# Altium project EDR_to_submit.PrjPcb
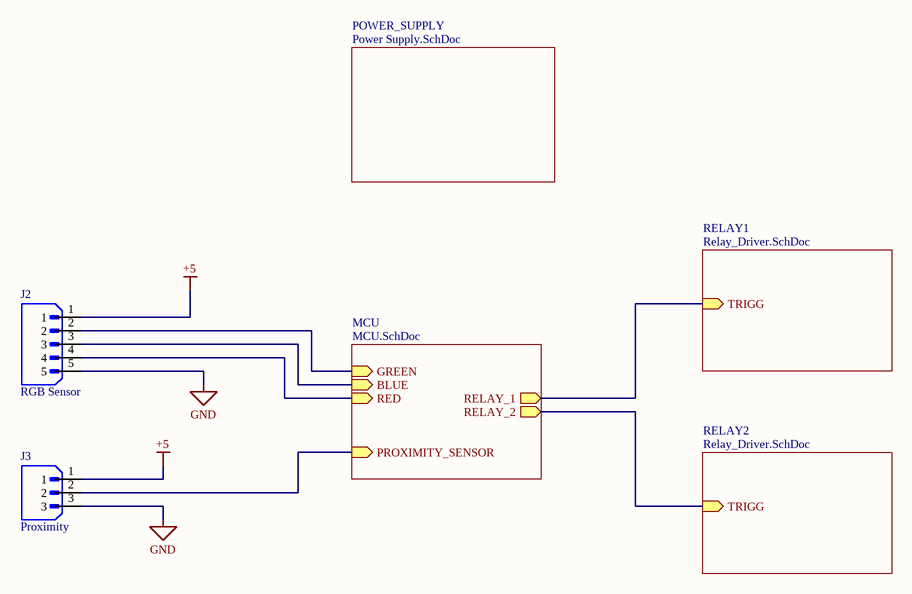
[diagram p0: Main.SchDoc]
4 sheets, 23 parts. Net scope: hierarchical (ports join the sheet entries above them; power ports are global).
Board file: PCB1.PcbDoc
Sheets:
  Main.SchDoc
    MCU = MCU.SchDoc
    RELAY1 = Relay_Driver.SchDoc
    POWER_SUPPLY = Power Supply.SchDoc
    RELAY2 = Relay_Driver.SchDoc

## Sheet Main.SchDoc: Main Circuit
size A; SheetNumber: 1; SheetTotal: 4

### Parts
J2  RGB Sensor  [JST_B5B-XH-A(LF)(SN)]
J3  Proximity  [JST_B3B-XH-A (LF)(SN)]

### Sub-sheets
MCU = MCU.SchDoc: GREEN (in), RELAY_1 (out), BLUE (in), RELAY_2 (out), PROXIMITY_SENSOR (in), RED (in)
POWER_SUPPLY = Power Supply.SchDoc: no entries
RELAY1 = Relay_Driver.SchDoc: TRIGG (in)
RELAY2 = Relay_Driver.SchDoc: TRIGG (in)

### Nets
+5: J2.1 J3.1
GND: J2.5 J3.3
NetJ2_2: J2.2 ; sheet MCU/GREEN
NetJ2_3: J2.3 ; sheet MCU/BLUE
NetJ2_4: J2.4 ; sheet MCU/RED
NetJ3_2: J3.2 ; sheet MCU/PROXIMITY_SENSOR
NetR2A_1: sheet MCU/RELAY_1, sheet RELAY1/TRIGG
NetR2B_1: sheet MCU/RELAY_2, sheet RELAY2/TRIGG

### Library data of the parts
J2 = B5B-XH-A(LF)(SN): Connector Header Through Hole 5 position 0.098 (2.50mm); MF: JST Sales America Inc.; SnapEDA_Link: https://www.snapeda.com/parts/B5B-XH-A(LF)(SN)/JST+Sales+America+Inc./view-part/?ref=snap; Package: None; Value: *; MP: B5B-XH-A(LF)(SN); Check_prices: https://www.snapeda.com/parts/B5B-XH-A(LF)(SN)/JST+Sales+America+Inc./view-part/?ref=eda
J3 = B3B-XH-A_(LF)(SN): Connector Header Through Hole 3 position 0.098 (2.50mm); MF: JST Sales America Inc.; MP: B3B-XH-A (LF)(SN); SnapEDA_Link: https://www.snapeda.com/parts/B3B-XH-A%20(LF)(SN)/JST+Sales+America+Inc./view-part/?ref=snap; Package: None; Value: *; Check_prices: https://www.snapeda.com/parts/B3B-XH-A%20(LF)(SN)/JST+Sales+America+Inc./view-part/?ref=eda

## Sheet MCU.SchDoc: Microcontroller circuit
size A; DrawnBy: Nidula Gunawardana; SheetNumber: 2; SheetTotal: 4
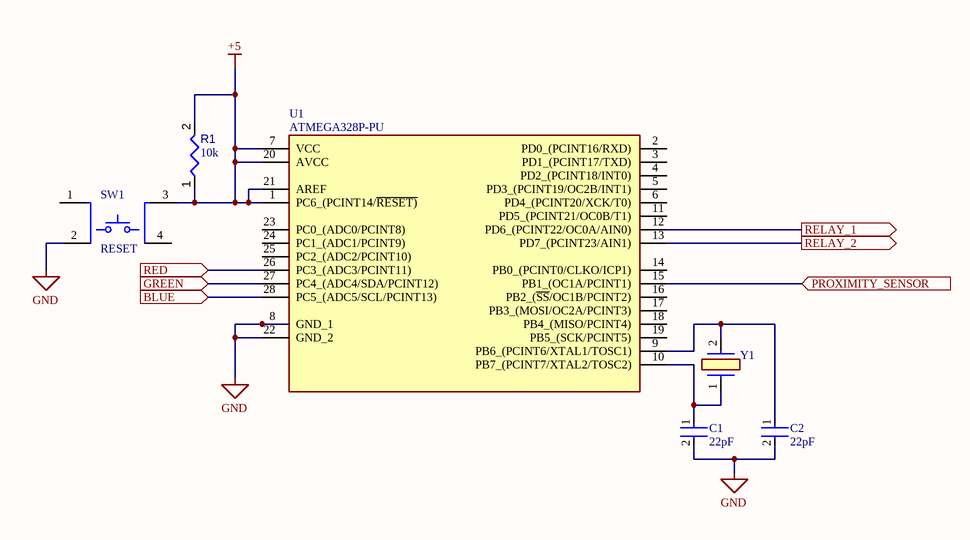
[diagram p1: MCU.SchDoc]

### Parts
C1  22pF  [FP-RCE0DB-MFG]
C2  22pF  [FP-RCE0DB-MFG]
R1  value 10k  [RESA60-630X240]  (hidden comment: MFR-25FBF52-10K)
SW1  RESET  [FP-SKQBARA010-MFG]
U1  ATMEGA328P-PU  [DIP794W53P254L3467H457Q28N]
Y1  ECS-160-S-4X  [ECS160S4X]  (value not drawn)

### Ports
BLUE (in), GREEN (in), PROXIMITY_SENSOR (in), RED (in), RELAY_1 (out), RELAY_2 (out)

### Nets
+5: R1.1 R1.2 SW1.3 U1.1(PC6_(PCINT14/~{RESET)}) U1.7(VCC) U1.20(AVCC) U1.21(AREF)
GND: C1.2 C2.2 SW1.2 U1.8(GND_1) U1.22(GND_2)
NetC1_1: C1.1 U1.10(PB7_(PCINT7/XTAL2/TOSC2)) Y1.1
NetC2_1: C2.1 U1.9(PB6_(PCINT6/XTAL1/TOSC1)) Y1.2
NetJ2_2: U1.27(PC4_(ADC4/SDA/PCINT12)) ; port GREEN
NetJ2_3: U1.28(PC5_(ADC5/SCL/PCINT13)) ; port BLUE
NetJ2_4: U1.26(PC3_(ADC3/PCINT11)) ; port RED
NetJ3_2: U1.15(PB1_(OC1A/PCINT1)) ; port PROXIMITY_SENSOR
NetR2A_1: U1.12(PD6_(PCINT22/OC0A/AIN0)) ; port RELAY_1
NetR2B_1: U1.13(PD7_(PCINT23/AIN1)) ; port RELAY_2

Not connected (* = marked no-connect by the designer): SW1 1 4; U1 2(PD0_(PCINT16/RXD)) 3(PD1_(PCINT17/TXD)) 4(PD2_(PCINT18/INT0)) 5(PD3_(PCINT19/OC2B/INT1)) 6(PD4_(PCINT20/XCK/T0)) 11(PD5_(PCINT21/OC0B/T1)) 14(PB0_(PCINT0/CLKO/ICP1)) 16(PB2_(~{SS}/OC1B/PCINT2)) 17(PB3_(MOSI/OC2A/PCINT3)) 18(PB4_(MISO/PCINT4)) 19(PB5_(SCK/PCINT5)) 23(PC0_(ADC0/PCINT8)) 24(PC1_(ADC1/PCINT9)) 25(PC2_(ADC2/PCINT10))

### Library data of the parts
C1 C2 = CMP-06035-047347-1: Cap Ceramic 22pF 100V C0G ±5% Radial 2.5mm +125°C Ammo Pack; Lead Diameter: 0.5mm; Lead/Base Style: Straight; Height: 3.5mm; Voltage: 100V; Mount: Through Hole; Min Operating Temperature: -55°C; Height - Seated (Max): 0.138inch; Dielectric: C0G; Width: 0.098inch; Depth: 2.5mm; Lead Pitch: 0.098inch; Packaging: Tape and Reel; Voltage Rating (DC): 100V; Capacitance: 22pF; Package Quantity: 2000; Max Operating Temperature: 125°C; Tolerance: 5%; Termination: Radial; Voltage Rating: 100V; Case/Package: Radial; Resistor Type: Ceramic; Length: 3.6mm; Ratings: AEC-Q200
R1 = CMP-009-00047-4: Axial Resistor, 10 KOhm, +/- 1%, 0.25 W, -55 to 155 degC, 2-Pin THD, RoHS, Bulk; Manufacturer: Yageo; Power: 250mW; Voltage Rating: 250V; Manufacturer URL: http://www.yageo.com/; Datasheet URL: http://www.yageo.com/documents/recent/Yageo%20LR_MFR_2013.pdf; Package Reference: MFR-25; Min Operating Temperature: -55°C; Mounting Technology: TH; Package Quantity: 200; Case/Package: Axial; Tolerance: 1%; RoHS Compliant: True; Datasheet Version: Apr-13; Packaging: Bulk; Max Operating Temperature: 155°C; Package Description: 2-Pin Axial Lead, Dia 2.4 mm, Body Length 6.3 mm
SW1 = CMP-00631-07849992-1: SKQBARA010 Switch Tactile N.O. SPST Round Button PC Pins 0.05A 12VDC 1.57N Thru-Hole Automotive; Life (Cycles): 100kcycles; Max Voltage Rating (DC): 12V; Contact Current Rating: 50mA; Contact Resistance: 500mΩ; Actuator Length: 850µm; Number of Positions: 2; Max Operating Temperature: 90°C; Throw Configuration: SPST; Contact Plating: Silver; Electrical Life: 100kcycles; RoHS: Compliant; Height: 5mm; Voltage Rating (DC): 12V; Termination: PC Pins; Orientation: Straight; Depth: 10.3mm; NexarPartId: 7849992; Packaging: Bulk; Color: Grey; Operating Force: 1.57N; Radiation Hardening: No; Schedule B: 8536509065, 8536509065; Current Rating: 50mA; Lead Free: Lead Free; Length: 10mm; Mount: Through Hole; Max Current Rating: 50mA; Min Operating Temperature: -40°C
U1 = ATMEGA328P-PU: Integrated Circuit; Manufacturer_Name: Microchip; Datasheet Link: https://www.mouser.ca/datasheet/2/268/ATmega48A_PA_88A_PA_168A_PA_328_P_DS_DS40002061B-3050139.pdf; Height: 4.572mm; Manufacturer_Part_Number: ATMEGA328P-PU; Mouser Part Number: 556-ATMEGA328P-PU; Mouser Price/Stock: https://www.mouser.co.uk/ProductDetail/Microchip-Technology/ATMEGA328P-PU?qs=K8BHR703ZXguOQv3sKbWcg%3D%3D; Arrow Part Number: ATMEGA328P-PU; Arrow Price/Stock: https://www.arrow.com/en/products/atmega328p-pu/microchip-technology?region=europe
Y1 = ECS-160-S-4X: Crystal or Oscillator; Manufacturer_Name: ECS; Datasheet Link: http://www.ecsxtal.com/store/pdf/hc-49usx.pdf; Height: 3.5mm; Manufacturer_Part_Number: ECS-160-S-4X; Mouser Part Number: 520-HCU1600-SX; Mouser Price/Stock: https://www.mouser.co.uk/ProductDetail/ECS/ECS-160-S-4X?qs=CNVyLAqdhH109We7RtSowA%3D%3D; Arrow Part Number: ECS-160-S-4X; Arrow Price/Stock: https://www.arrow.com/en/products/ecs-160-s-4x/ecs-international?region=nac

## Sheet Relay_Driver.SchDoc: Relay Unit
size A; SheetNumber: 3; SheetTotal: 4
Used 2 times, as channels RELAY1, RELAY2. Parts and nets are listed once, with the designators drawn on the sheet.
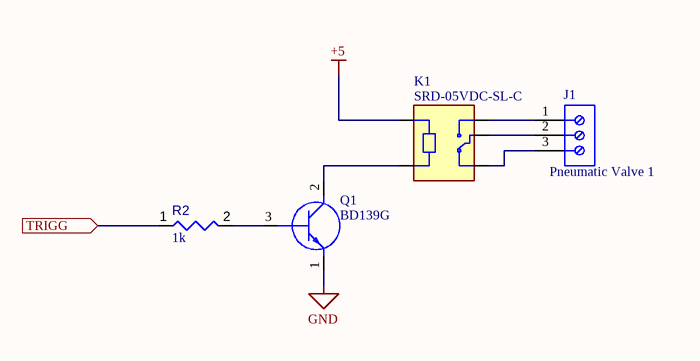
[diagram p2: Relay_Driver.SchDoc]

### Parts
J1  Pneumatic Valve 1  [691101710003]
K1  SRD-05VDC-SL-C  [RELAY_SRD-05VDC-SL-C]
Q1  BD139G  [TO229P300X760X1364-3P]
R2  value 1k  [RESA60-630X240]  (hidden comment: MFR-25FBF52-1K)

### Ports
TRIGG (in)

### Nets
+5: K1.A1
GND: Q1.1(E)
TRIGG: R2.1 ; port TRIGG
NetJ1_1: J1.1 K1.NO
NetJ1_2: J1.2 K1.COM
NetJ1_3: J1.3 K1.NC
NetK1_A2: K1.A2 Q1.2(C)
NetQ1_3: Q1.3(B) R2.2

### Channels
RELAY1: designators end in A; ports TRIGG=NetR2A_1
RELAY2: designators end in B; ports TRIGG=NetR2B_1

### Library data of the parts
J1 = CMP-1502-03257-2: NexarPartId: 8917705; Voltage Rating: 250V; Current: 16A; Wire Gauge (Min): 14AWG; Pitch: 5.0038mm; Wire Gauge (Max): 26AWG; Number of Positions Per Level: 3; Plating: Steel; Number of Levels: 1; Stripping Length: -7mm; REACH SVHC: Unknown; Width: 16.2mm; Height: 16.4mm; Contact Material: Brass; RoHS: Compliant; Color: Blue; Contact Plating: Tin; Lead Pitch: 5mm; Packaging: Box; Termination: Screw; Number of Contacts: 3; Wire/Cable Gauge: 26AWG; Min Operating Temperature: -40°C; Max Operating Temperature: 105°C; Housing Material: Nylon; Length: 9mm; Voltage: 250V; Mount: Through Hole; Current Rating: 16A; Number of Pins: 3
K1 = SRD-05VDC-SL-C: 5V Trigger Relay Module For Arduino And Raspberry Pi 5V Trigger Relay Module For Arduino And Raspberry Pi; MF: Songle Relay; Check_prices: https://www.snapeda.com/parts/SRD-05VDC-SL-C/Songle+Relay/view-part/?ref=eda; Value: *; Availability: Not in stock; Price: None; Package: NON STANDARD-5 Songle Relay; MP: SRD-05VDC-SL-C; SnapEDA_Link: https://www.snapeda.com/parts/SRD-05VDC-SL-C/Songle+Relay/view-part/?ref=snap
Q1 = BD139G: Transistor BJT NPN; Manufacturer_Name: onsemi; Datasheet Link: http://www.onsemi.com/pub/Collateral/BD135-D.PDF; Height: 3mm; Manufacturer_Part_Number: BD139G; Mouser Part Number: 863-BD139G; Mouser Price/Stock: https://www.mouser.co.uk/ProductDetail/onsemi/BD139G?qs=vNc2DXHODiLIqGggNMT6cg%3D%3D; Arrow Part Number: BD139G; Arrow Price/Stock: https://www.arrow.com/en/products/bd139g/on-semiconductor?region=nac
R2 = CMP-009-00048-4: Axial Resistor, 1 KOhm, +/- 1%, 250 mW, -55 to 155 degC, 2-Pin THD, RoHS, Bulk; Manufacturer: Yageo; Voltage Rating: 250V; Power: 250mW; Min Operating Temperature: -55°C; Max Operating Temperature: 155°C; Tolerance: 1%; Package Reference: MFR-25; Composition: CarbonFilm; Mounting Technology: TH; Packaging: Bulk; Case/Package: Axial; Datasheet URL: http://www.yageo.com/documents/recent/Yageo%20LR_MFR_2013.pdf; Package Quantity: 200; Manufacturer URL: http://www.yageo.com/; Package Description: 2-Pin Axial Lead, Dia 2.4 mm, Body Length 6.3 mm; Datasheet Version: Apr-13; RoHS Compliant: True

## Sheet Power Supply.SchDoc: Power supply Unit
size A; SheetNumber: 4; SheetTotal: 4
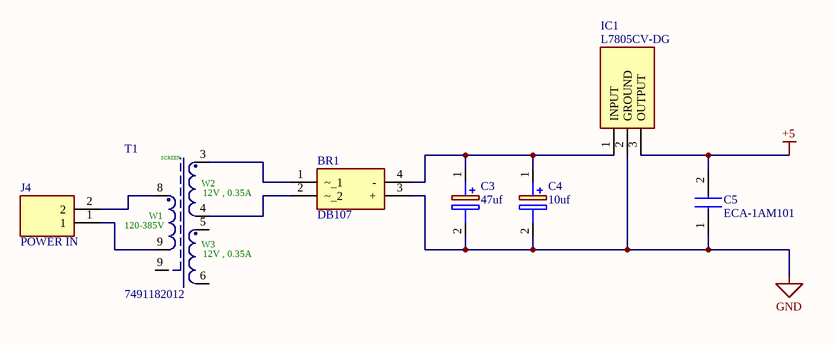
[diagram p3: Power Supply.SchDoc]

### Parts
BR1  DB107  [DIP825W50P510L830H340Q4N]
C3  47uf  [CAPPRD250W55D630H1220]
C4  10uf  [CAPPRD200W55D500H1200]
C5  ECA-1AM101  [CAPPRD200W55D525H1200]
IC1  L7805CV-DG  [TO255P460X1020X2008-3P]
J4  POWER IN  [TB00250002BE]
T1  7491182012  [EE16_7_4 (E16)]

### Nets
+5: C5.2(-) IC1.3(OUTPUT)
GND: BR1.3(+) C3.2(-) C4.2(-) C5.1(+) IC1.2(GROUND)
NetBR1_1: BR1.1(~_1) T1.3
NetBR1_2: BR1.2(~_2) T1.4
NetBR1_4: BR1.4(-) C3.1(+) C4.1(+) IC1.1(INPUT)
NetJ4_1: J4.1 T1.9
NetJ4_2: J4.2 T1.8

Not connected (* = marked no-connect by the designer): T1 5 6

### Notes on the sheet
- (in symbol CMP-1471-00001-1) SCREEN; W2; 12V , 0.35A; W1; 120-385V; W3

### Library data of the parts
BR1 = DB107: Bridge Rectifier; Manufacturer_Name: Rectron; Datasheet Link: https://www.rectron.com/data_sheets/db101-107.pdf; Height: 3.4mm; Manufacturer_Part_Number: DB107; Mouser Part Number: 583-DB107; Mouser Price/Stock: https://www.mouser.co.uk/ProductDetail/Rectron/DB107?qs=G5AQjGfRJcLGAY%252B6bEDnbw%3D%3D
C3 = ECE-A1EN470UB: Capacitor Polarised; Manufacturer_Name: Panasonic; Datasheet Link: http://industrial.panasonic.com/cdbs/www-data/pdf/RDF0000/ABA0000C1053.pdf; Height: 12.2mm; Manufacturer_Part_Number: ECE-A1EN470UB; Mouser Part Number: 667-ECE-A1EN470UB; Mouser Price/Stock: https://www.mouser.co.uk/ProductDetail/Panasonic/ECE-A1EN470UB?qs=rMMd5vBiahp%252B1Xr0dP1Lmg%3D%3D
C4 = ECA-1EM100: Capacitor Polarised; Manufacturer_Name: Panasonic; Datasheet Link: https://componentsearchengine.com/Datasheets/2/ECA-1EM100.pdf; Height: 12mm; Manufacturer_Part_Number: ECA-1EM100; Mouser Part Number: 667-ECA-1EM100; Mouser Price/Stock: https://www.mouser.com/Search/Refine.aspx?Keyword=667-ECA-1EM100; Arrow Part Number: ECA-1EM100; Arrow Price/Stock: https://www.arrow.com/en/products/eca1em100/panasonic
C5 = ECA-1AM101: Capacitor; Manufacturer_Name: Panasonic; Datasheet Link: http://uk.rs-online.com/web/p/products/8073233; Height: 12mm; Manufacturer_Part_Number: ECA-1AM101; Mouser Part Number: 667-ECA-1AM101; Mouser Price/Stock: https://www.mouser.co.uk/ProductDetail/Panasonic/ECA-1AM101?qs=o8jAzVTWolupLSuBsMrKhQ%3D%3D; Arrow Part Number: ECA-1AM101; Arrow Price/Stock: https://www.arrow.com/en/products/eca-1am101/panasonic?region=nac
IC1 = L7805CV-DG: Integrated Circuit; Manufacturer_Name: STMicroelectronics; Datasheet Link: http://www.st.com/web/en/resource/technical/document/datasheet/CD00000444.pdf; Height: 4.6mm; Manufacturer_Part_Number: L7805CV-DG; Mouser Part Number: 511-L7805CV-DG; Mouser Price/Stock: https://www.mouser.co.uk/ProductDetail/STMicroelectronics/L7805CV-DG?qs=T%2FOtf55vL7c3O0as9P9fAw%3D%3D; Arrow Part Number: L7805CV-DG; Arrow Price/Stock: https://www.arrow.com/en/products/l7805cv-dg/stmicroelectronics?region=europe
J4 = TB002-500-02BE: Connector; Manufacturer_Name: CUI Devices; Datasheet Link: https://eu.mouser.com/datasheet/2/670/tb002_500-1550579.pdf; Height: 10.4mm; Manufacturer_Part_Number: TB002-500-02BE; Mouser Part Number: 490-TB002-500-02BE; Mouser Price/Stock: https://www.mouser.co.uk/ProductDetail/CUI-Devices/TB002-500-02BE?qs=vLWxofP3U2x9716kcgva%2Fw%3D%3D; Arrow Part Number: TB002-500-02BE; Arrow Price/Stock: https://www.arrow.com/en/products/tb002-500-02be/cui-devices?region=nac
T1 = CMP-1471-00001-1: Off-Line Transformer WE-UNIT , L=0.9mH; Manufacturer: Wuerth Elektronik; Turns Ratio: "9.5","1:1"; Inductance: 0.9mH; Output Voltage (DC): 12; Output Current (A): 0.6; Input Voltage (AC): 85-265; ComponentLink1Description: Manufacturer URL; ComponentLink1URL: http://www.we-online.com; PackageReference: EE16_7_4 (E16); ComponentLink2Description: Datasheet; ComponentLink2URL: http://www.we-online.de/katalog/media/pdf/7491182012.pdf; PartNumber: 7491182012

## Nets that join several sheets
+5: Main (J2.1 J3.1), MCU (7 pins), RELAY1 (K1A.A1), Power Supply (C5.2 IC1.3), RELAY2 (K1B.A1)
GND: Main (J2.5 J3.3), MCU (5 pins), RELAY1 (Q1A.1), Power Supply (5 pins), RELAY2 (Q1B.1)
NetJ2_2: Main (J2.2), MCU (U1.27)
NetJ2_3: Main (J2.3), MCU (U1.28)
NetJ2_4: Main (J2.4), MCU (U1.26)
NetJ3_2: Main (J3.2), MCU (U1.15)
NetR2A_1: MCU (U1.12), RELAY1 (R2A.1)
NetR2B_1: MCU (U1.13), RELAY2 (R2B.1)